# EAGLE schematic HOME AUTOMATION (EAGLE 9.5.0)
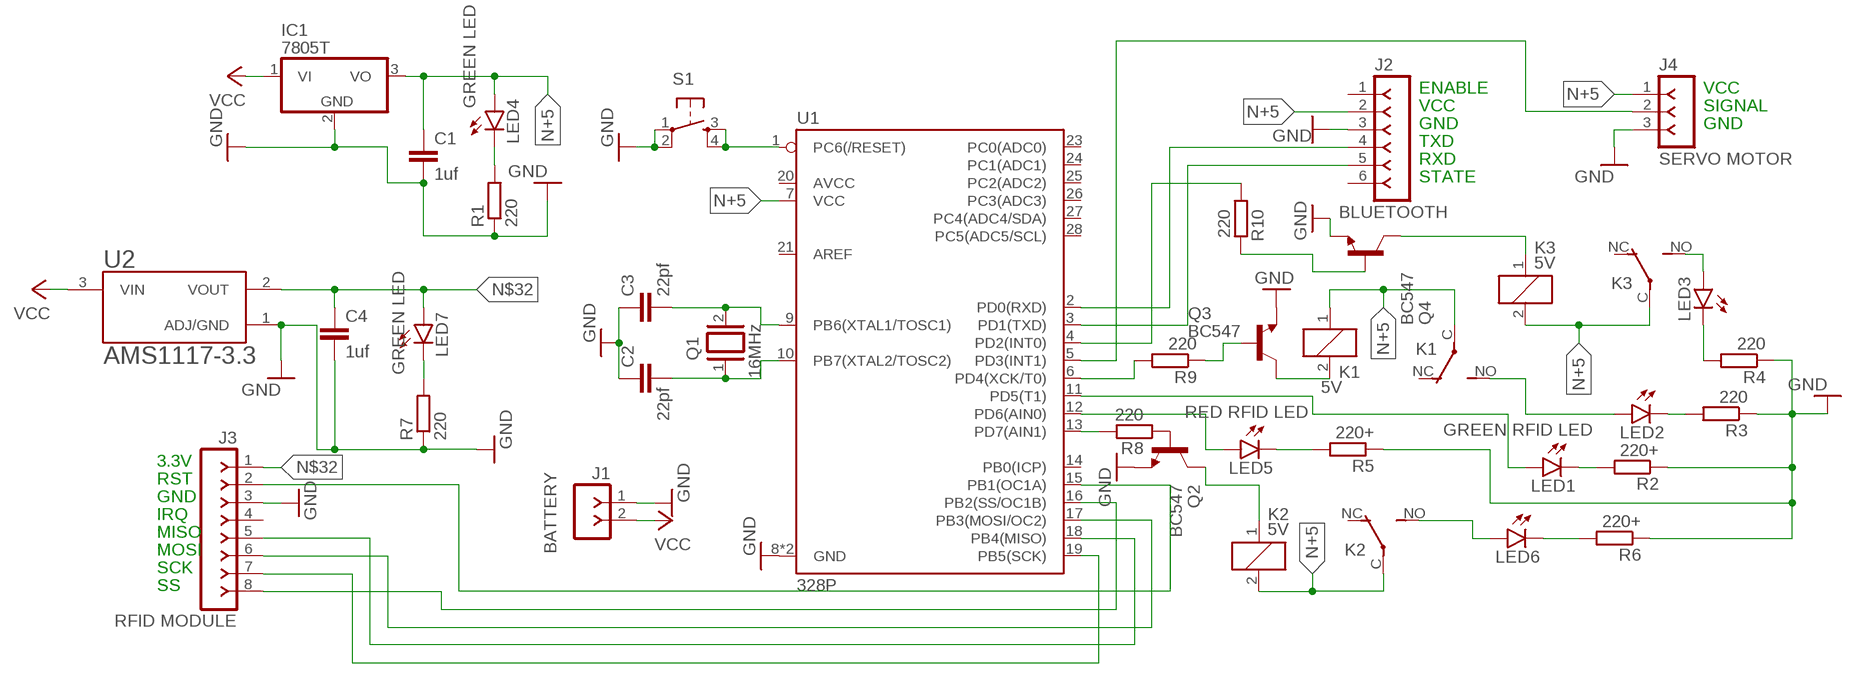
[diagram p0: schematic, sheet 1]

## Parts
C1  1uf  C-EU025-025X050  [C025-025X050]
C2  22pf  C-EU025-025X050  [C025-025X050]
C3  22pf  C-EU025-025X050  [C025-025X050]
C4  1uf  C-EU025-025X050  [C025-025X050]
IC1  7805T  [TO220H]
J1  BATTERY  F-1X02-SIP-100-32Y  [SIP-100-02-32Y]
J2  BLUETOOTH  F-1X06-SIP-100-32Y  [SIP-100-06-32Y]
J3  RFID MODULE  F-1X08-SIP-100-32Y  [SIP-100-08-32Y]
J4  SERVO MOTOR  F-1X03-SIP-100-32Y  [SIP-100-03-32Y]
K1  5V  CQ1-12V  [CQ1]
K2  5V  CQ1-12V  [CQ1]
K3  5V  CQ1-12V  [CQ1]
LED1  GREEN RFID LED  LED5MM  [LED5MM]
LED2  LED5MM  [LED5MM]
LED3  LED5MM  [LED5MM]
LED4  GREEN LED  LED5MM  [LED5MM]
LED5  RED RFID LED  LED5MM  [LED5MM]
LED6  LED5MM  [LED5MM]
LED7  GREEN LED  LED5MM  [LED5MM]
Q1  16MHz  XTAL/S  [QS]
Q2  BC547  [TO92]
Q3  BC547  [TO92]
Q4  BC547  [TO92]
R1  220  R-EU_0204/7  [0204/7]
R2  220+  R-EU_0204/7  [0204/7]
R3  220  R-EU_0204/7  [0204/7]
R4  220  R-EU_0204/7  [0204/7]
R5  220+  R-EU_0204/7  [0204/7]
R6  220+  R-EU_0204/7  [0204/7]
R7  220  R-EU_0204/7  [0204/7]
R8  220  R-EU_0204/7  [0204/7]
R9  220  R-EU_0204/7  [0204/7]
R10  220  R-EU_0204/7  [0204/7]
S1  TAC_SWITCHPTH  [TACTILE-PTH]
U1  328P  ATMEGA328P_PDIP  [DIP28]
U2  AMS1117-3.3  [SOT229P700X180-4N]

## Nets
GND: C1.2 C2.1 C3.1 C4.2 IC1.2(GND) J1.1 J2.3 J3.3 J4.3 Q2.1(E) Q3.1(E) Q4.1(E) R1.1 R2.1 R3.1 R4.1 R5.1 R6.1 R7.1 S1.1 S1.2 U1.8(GND) U1.22(GND) U2.1(ADJ/GND)
N$1: U1.7(VCC)
N$2: S1.3 S1.4 U1.1(PC6(/RESET))
N$3: C3.2 Q1.2 U1.9(PB6(XTAL1/TOSC1))
N$4: K2.2 K2.C(2:P)
N$5: C2.2 Q1.1 U1.10(PB7(XTAL2/TOSC2))
N$6: R9.2 U1.6(PD4(XCK/T0))
N$7: K1.1 K1.C(2:P)
N$8: LED1.A U1.11(PD5(T1))
N$9: K3.2 K3.C(2:P)
N$10: K3.1 Q4.3(C)
N$11: LED4.K(C) R1.2
N$12: LED5.A U1.12(PD6(AIN0))
N$13: LED1.K(C) R2.2
N$14: K1.NO(2:S) LED2.A
N$15: LED2.K(C) R3.2
N$16: LED3.K(C) R4.2
N$17: K3.NO(2:S) LED3.A
N$18: LED5.K(C) R5.2
N$19: R8.2 U1.13(PD7(AIN1))
N$20: K2.NO(2:S) LED6.A
N$21: LED6.K(C) R6.2
N$22: J2.4 U1.2(PD0(RXD))
N$23: J2.5 U1.3(PD1(TXD))
N$24: J2.2
N$25: LED7.K(C) R7.2
N$26: J3.1
N$27: J3.7 U1.19(PB5(SCK))
N$28: J3.5 U1.18(PB4(MISO))
N$29: J3.6 U1.17(PB3(MOSI/OC2))
N$30: J3.8 U1.16(PB2(SS/OC1B))
N$31: J3.2 U1.15(PB1(OC1A))
N$32: C4.1 LED7.A U2.2(VOUT)
N$33: J4.1
N$34: K2.1 Q2.3(C)
N$35: J4.2 U1.5(PD3(INT1))
N$36: Q2.2(B) R8.1
N$37: Q3.2(B) R9.1
N$38: K1.2 Q3.3(C)
N$39: R10.1 U1.4(PD2(INT0))
N$40: Q4.2(B) R10.2
N+5: C1.1 IC1.3(VO) LED4.A
VCC: IC1.1(VI) J1.2 U2.3(VIN)
Unconnected: J2.1 J2.6 J3.4 K1.NC(2:O) K2.NC(2:O) K3.NC(2:O) U1.14(PB0(ICP)) U1.20(AVCC) U1.21(AREF) U1.23(PC0(ADC0)) U1.24(PC1(ADC1)) U1.25(PC2(ADC2)) U1.26(PC3(ADC3)) U1.27(PC4(ADC4/SDA)) U1.28(PC5(ADC5/SCL))

## Notes on the sheet
- ENABLE | VCC
- VCC | SIGNAL
- GND | GND
- TXD
- RXD
- STATE
- 3.3V
- RST
- GND
- IRQ
- MISO
- MOSI
- SCK
- SS

## Library data of the parts
C1-C4 = rcl:C-EU: CAPACITOR, European symbol; SPICEPREFIX: C
IC1 = linear:78*: Positive VOLTAGE REGULATOR Source: http://cache.national.com/ds/LM/LM78L05.pdf http://www.fairchildsemi.com/ds/LM/LM7805.pdf
J1 = con-headers-jp:F-1X02-: FEMALE HEADER
J2 = con-headers-jp:F-1X06-: FEMALE HEADER
J3 = con-headers-jp:F-1X08-: FEMALE HEADER
J4 = con-headers-jp:F-1X03-: FEMALE HEADER
K1-K3 = relay:CQ1-12V: AUTOMOTIVE QUIET RELAY NAiS Source: http://www.mew-europe.com/.. en_ds_61208_0000.pdf; OC_FARNELL: unknown; OC_NEWARK: unknown
LED1-LED7 = led:LED: LED OSRAM: - CHIPLED LG R971, LG N971, LY N971, LG Q971, LY Q971, LO R971, LY R971 LH N974, LH R974 LS Q976, LO Q976, LY Q976 LO Q996 - Hyper CHIPLED LW Q18S LB Q993, LB Q99A, LB R99A - SideLED LS A670, LO A670, LY A670, LG A670, LP A670 LB A673, LV A673, LT A673, LW A673 LH A674 LY A675 LS A676, LA A676, LO A676, LY A676, LW A676 LS A679, LY A679, LG A679 - Hyper Micro SIDELED® LS Y876, LA Y876, LO Y876, LY Y876 LT Y87S - SmartLED LW L88C, LW L88S LB L89C, LB L89S, LG L890 LS L89K, LO L89K, LY L89K LS L896, LA L896, LO L896, LY L896 - TOPLED LS T670, LO T670, LY T670, LG T670, LP T670 LSG T670, LSP T670, LSY T670, LOP T670, LYG T670 LG T671, LOG T671, LSG T671 LB T673, LV T673, LT T673, LW T673 LH T674 LS T676, LA T676, LO T676, LY T676, LB T676, LH T676, LSB T676, LW T676 LB T67C, LV T67C, LT T67C, LS T67K, LO T67K, LY T67K, LW E67C LS E67B, LA E67B, LO E67B, LY E67B, LB E67C, LV E67C, LT E67C LW T67C LS T679, LY T679, LG T679 LS T770, LO T770, LY T770, LG T770, LP T770 LB T773, LV T773, LT T773, LW T773 LH T774 LS E675, LA E675, LY E675, LS T675 LS T776, LA T776, LO T776, LY T776, LB T776 LHGB T686 LT T68C, LB T68C - Hyper Mini TOPLED® LB M676 - Mini TOPLED Santana® LG M470 LS M47K, LO M47K, LY M47K Source: http://www.osram.convergy.de LUXEON: - LUMILED® LXK2-PW12-R00, LXK2-PW12-S00, LXK2-PW14-U00, LXK2-PW14-V00 LXK2-PM12-R00, LXK2-PM12-S00, LXK2-PM14-U00 LXK2-PE12-Q00, LXK2-PE12-R00, LXK2-PE12-S00, LXK2-PE14-T00, LXK2-PE14-U00 LXK2-PB12-K00, LXK2-PB12-L00, LXK2-PB12-M00, LXK2-PB14-N00, LXK2-PB14-P00, LXK2-PB14-Q00 LXK2-PR12-L00, LXK2-PR12-M00, LXK2-PR14-Q00, LXK2-PR14-R00 LXK2-PD12-Q00, LXK2-PD12-R00, LXK2-PD12-S00 LXK2-PH12-R00, LXK2-PH12-S00 LXK2-PL12-P00, LXK2-PL12-Q00, LXK2-PL12-R00 Source: www.luxeon.com KINGBRIGHT: KA-3528ASYC Source: www.kingbright.com
Q1 = special:XTAL/S: CRYSTAL
Q2-Q4 = transistor-npn:BC547*: NPN Transistor
R1-R10 = rcl:R-EU_: RESISTOR, European symbol; SPICEPREFIX: R
S1 = SparkFun-Retired:TAC_SWITCH: Momentary Switch Button commonly used for reset or general input. Spark Fun Electronics SKU : COM-00097 SMT- SWCH-08247
U1 = SparkFun-IC-Microcontroller:ATMEGA328P_PDIP: Atmel 328P Through hole ATMEGA328P uC used in the Arduino 32kb flash, 1k EEPROM, 2k SRAM Datasheet <http://www.sparkfun.com/datasheets/Components/SMD/ATMega328.pdf> SparkFun Products Storefront component: AVR 28 Pin 20MHz 32K 6A/D - ATMega328P <https://www.sparkfun.com/products/9061> (COM-09061) SparkFun Simon Says - Through-Hole Soldering Kit <https://www.sparkfun.com/products/10547> (KIT-10547) SparkFun Learn to Solder - Simon Says <https://www.sparkfun.com/products/13708> (KIT-13708) SparkFun BigTime Watch Kit <https://www.sparkfun.com/products/11734> (KIT-11734) SparkFun ClockIt <https://www.sparkfun.com/products/10930> (KIT-10930) SparkFun Serial Enabled LCD Kit <https://www.sparkfun.com/products/10097> (LCD-10097) SparkFun Simon Tilts - Through Hole Soldering Kit <https://www.sparkfun.com/products/12634> (KIT-12634) SparkFun Frequency Counter Kit <https://www.sparkfun.com/products/10140> (KIT-10140) FabFM Radio Kit <https://www.sparkfun.com/products/11043> (KIT-11043) SparkFun Binary Blaster Kit <https://www.sparkfun.com/products/12037> (KIT-12037) SparkFun Metro-Gnome <https://www.sparkfun.com/products/9236> (KIT-09236) ATmega328 with Arduino Optiboot (Uno) <https://www.sparkfun.com/products/10524> (DEV-10524); PROD_ID: IC-09136
U2 = AMS1117-3.3:AMS1117-3.3: Sot223/Pkg 1-Amp 3.3-Volt Low Drop Out Voltage Regulatator; AVAILABILITY: Unavailable; DESCRIPTION: Sot-89; MF: Advanced Monolithic Systems; MP: AMS1117-3.3; PACKAGE: SOT-89 ams; PRICE: None